# Altium schematic sheet Transmit_Drain.SchDoc
size 558 x 431 mm; SheetNumber: 5; SheetTotal: 9
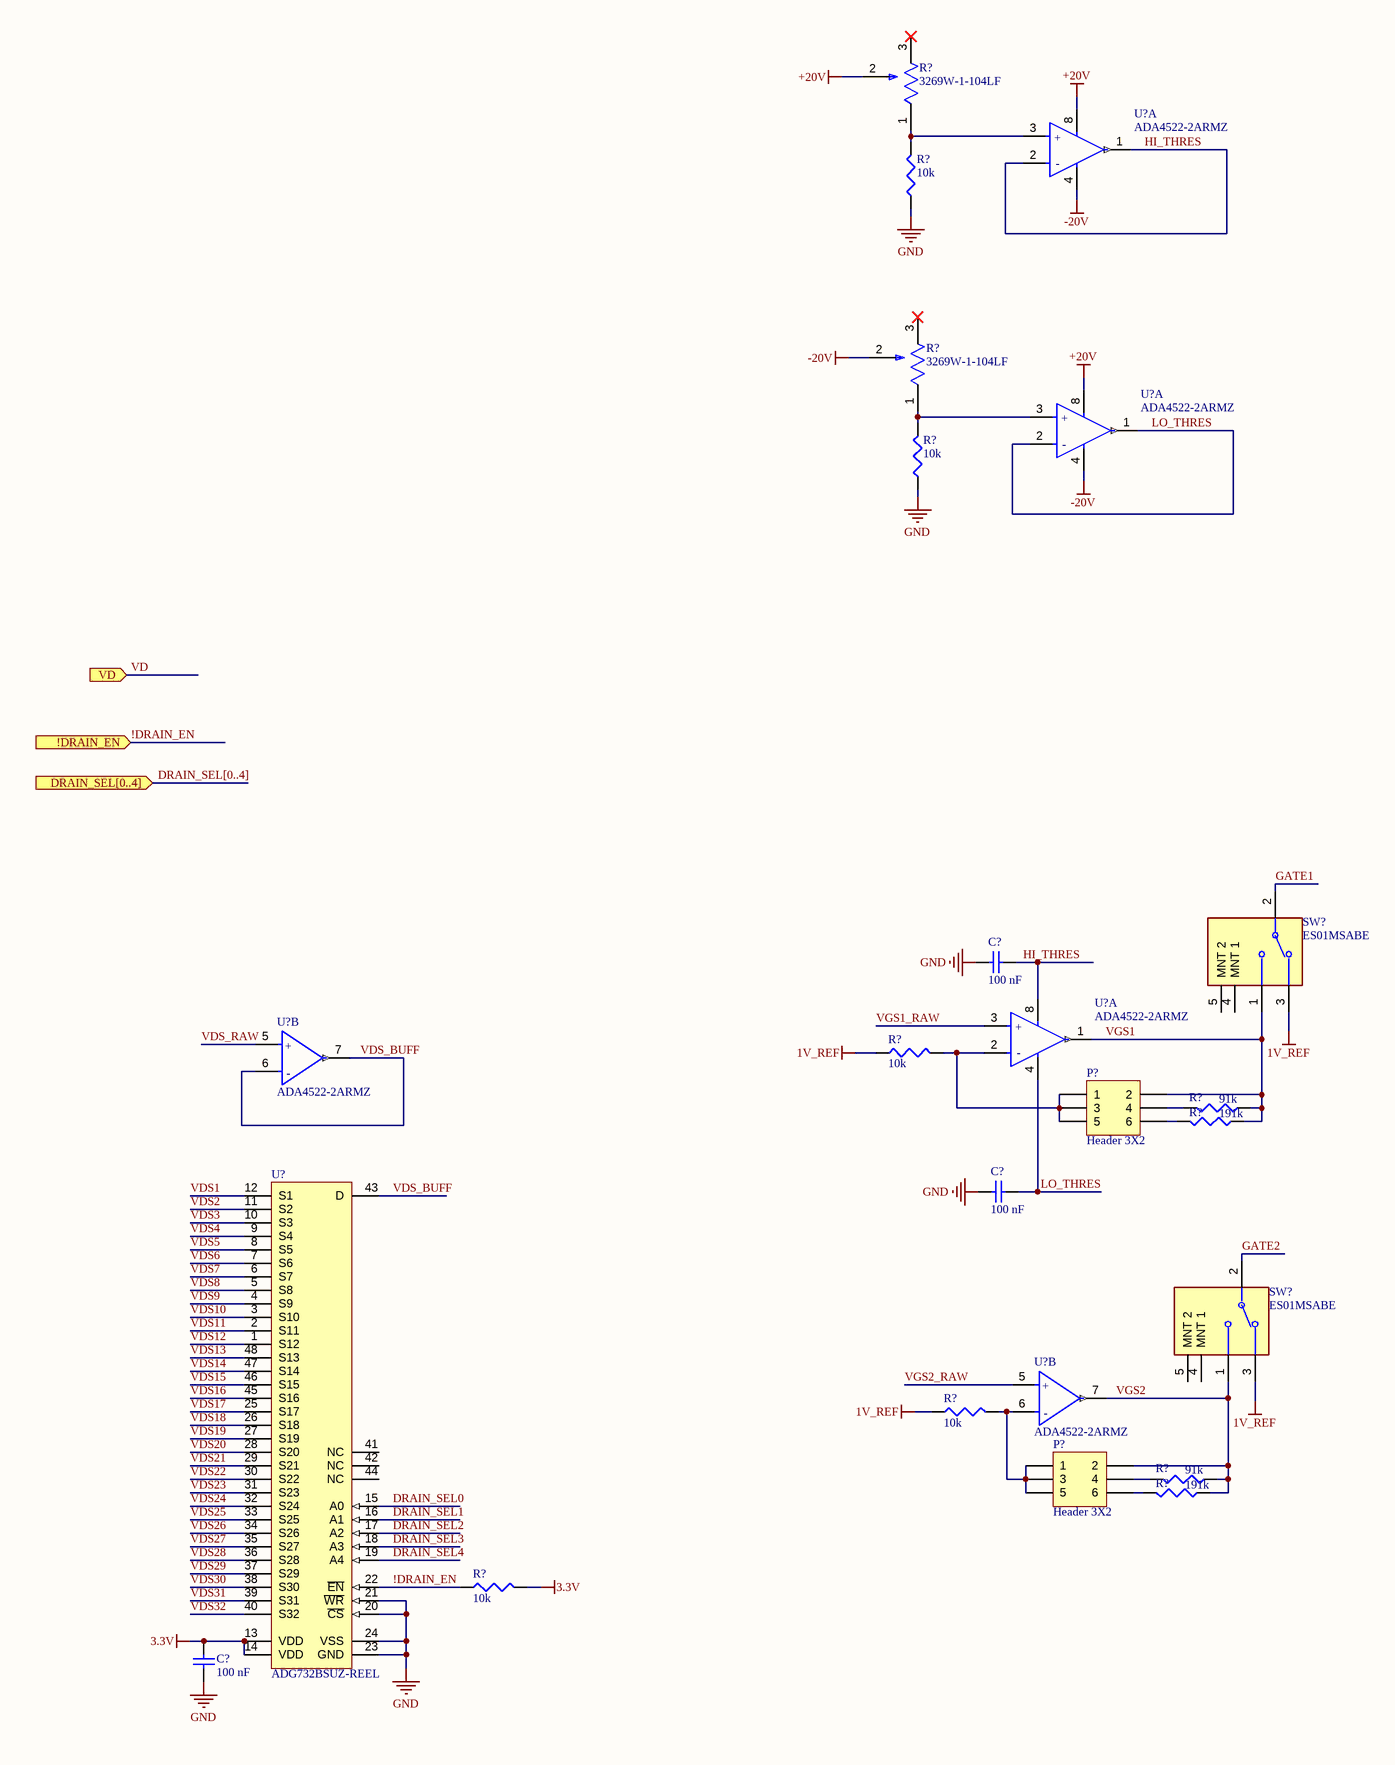
[diagram p0: Transmit_Drain.SchDoc, left]
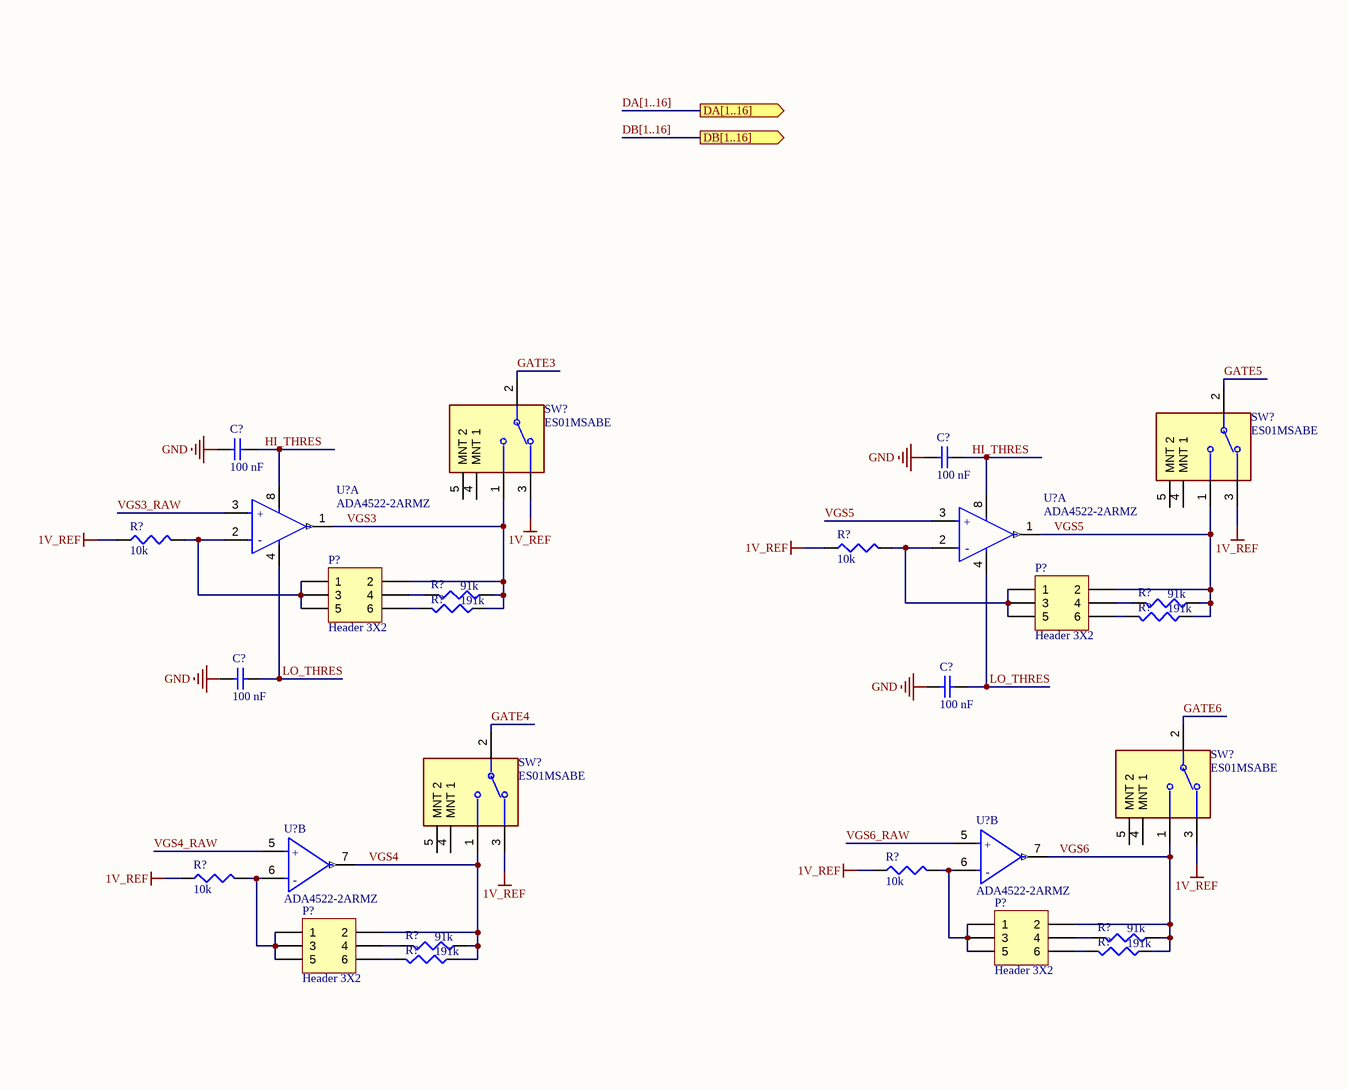
[diagram p1: Transmit_Drain.SchDoc, right]

## Parts
(Parts that share a designator on the sheet are numbered #1, #2 ... from top to bottom, then left to right.)
C?#1  100 nF  [1608[0603]]
C?#2  100 nF  [1608[0603]]
C?#3  100 nF  [1608[0603]]
C?#4  100 nF  [1608[0603]]
C?#5  100 nF  [1608[0603]]
C?#6  100 nF  [1608[0603]]
C?#7  100 nF  [1608[0603]]
P?#1  Header 3X2  [HDR2X3]
P?#2  Header 3X2  [HDR2X3]
P?#3  Header 3X2  [HDR2X3]
P?#4  Header 3X2  [HDR2X3]
P?#5  Header 3X2  [HDR2X3]
P?#6  Header 3X2  [HDR2X3]
R?#1  3269W-1-104LF  [FP-3269W-MFG]
R?#2  10k  [J1-0603]
R?#3  3269W-1-104LF  [FP-3269W-MFG]
R?#4  10k  [J1-0603]
R?#5  10k  [J1-0603]
R?#6  10k  [J1-0603]
R?#7  10k  [J1-0603]
R?#8  91k  [J1-0603]
R?#9  191k  [J1-0603]
R?#10  91k  [J1-0603]
R?#11  191k  [J1-0603]
R?#12  91k  [J1-0603]
R?#13  191k  [J1-0603]
R?#14  10k  [J1-0603]
R?#15  10k  [J1-0603]
R?#16  10k  [J1-0603]
R?#17  91k  [J1-0603]
R?#18  91k  [J1-0603]
R?#19  91k  [J1-0603]
R?#20  191k  [J1-0603]
R?#21  191k  [J1-0603]
R?#22  191k  [J1-0603]
R?#23  10k  [J1-0603]
SW?#1  ES01MSABE  [FP-ES01MSABE-MFG]
SW?#2  ES01MSABE  [FP-ES01MSABE-MFG]
SW?#3  ES01MSABE  [FP-ES01MSABE-MFG]
SW?#4  ES01MSABE  [FP-ES01MSABE-MFG]
SW?#5  ES01MSABE  [FP-ES01MSABE-MFG]
SW?#6  ES01MSABE  [FP-ES01MSABE-MFG]
U?#1  ADA4522-2ARMZ  [FP-RM-8-IPC_C]  (part A of 2)
U?#2  ADA4522-2ARMZ  [FP-RM-8-IPC_C]  (part A of 2)
U?#3  ADA4522-2ARMZ  [FP-RM-8-IPC_C]  (part A of 2)
U?#4  ADA4522-2ARMZ  [FP-RM-8-IPC_C]  (part B of 2)
U?#5  ADA4522-2ARMZ  [FP-RM-8-IPC_C]  (part A of 2)
U?#6  ADA4522-2ARMZ  [FP-RM-8-IPC_C]  (part A of 2)
U?#7  ADG732BSUZ-REEL  [ADI-SU-48_N]
U?#8  ADA4522-2ARMZ  [FP-RM-8-IPC_C]  (part B of 2)
U?#9  ADA4522-2ARMZ  [FP-RM-8-IPC_C]  (part B of 2)
U?#10  ADA4522-2ARMZ  [FP-RM-8-IPC_C]  (part B of 2)

## Ports
!DRAIN_EN (in), DA[1..16] (out), DB[1..16] (out), DRAIN_SEL[0..4] (in), VD (in)

## Nets
1V_REF: R?#5.1 R?#6.1 R?#7.1 R?#14.1 R?#15.1 R?#16.1 SW?#1.3 SW?#2.3 SW?#3.3 SW?#4.3 SW?#5.3 SW?#6.3
3.3V: C?#7.2 R?#23.2 U?#7.13(VDD) U?#7.14(VDD)
+20V: R?#1.2(WIPER) U?#1.8(V+) U?#2.8(V+)
-20V: R?#3.2(WIPER) U?#1.4(V-) U?#2.4(V-)
GND: C?#1.1 C?#2.1 C?#3.1 C?#4.1 C?#5.1 C?#6.1 C?#7.1 R?#2.1 R?#4.1 U?#7.20(~{CS}) U?#7.21(~{WR}) U?#7.23(GND) U?#7.24(VSS)
!DRAIN_EN: R?#23.1 U?#7.22(~{EN}) ; port !DRAIN_EN
DRAIN_SEL0: U?#7.15(A0)
DRAIN_SEL1: U?#7.16(A1)
DRAIN_SEL2: U?#7.17(A2)
DRAIN_SEL3: U?#7.18(A3)
DRAIN_SEL4: U?#7.19(A4)
GATE1: SW?#1.2(COMM)
GATE2: SW?#5.2(COMM)
GATE3: SW?#2.2(COMM)
GATE4: SW?#6.2(COMM)
GATE5: SW?#3.2(COMM)
GATE6: SW?#4.2(COMM)
HI_THRES: C?#1.2 C?#2.2 C?#3.2 U?#1.1(OUT_A) U?#1.2(-IN_A) U?#3.8(V+) U?#5.8(V+) U?#6.8(V+)
LO_THRES: C?#4.2 C?#5.2 C?#6.2 U?#2.1(OUT_A) U?#2.2(-IN_A) U?#3.4(V-) U?#5.4(V-) U?#6.4(V-)
VD: port VD
VDS1: U?#7.12(S1)
VDS2: U?#7.11(S2)
VDS3: U?#7.10(S3)
VDS4: U?#7.9(S4)
VDS5: U?#7.8(S5)
VDS6: U?#7.7(S6)
VDS7: U?#7.6(S7)
VDS8: U?#7.5(S8)
VDS9: U?#7.4(S9)
VDS10: U?#7.3(S10)
VDS11: U?#7.2(S11)
VDS12: U?#7.1(S12)
VDS13: U?#7.48(S13)
VDS14: U?#7.47(S14)
VDS15: U?#7.46(S15)
VDS16: U?#7.45(S16)
VDS17: U?#7.25(S17)
VDS18: U?#7.26(S18)
VDS19: U?#7.27(S19)
VDS20: U?#7.28(S20)
VDS21: U?#7.29(S21)
VDS22: U?#7.30(S22)
VDS23: U?#7.31(S23)
VDS24: U?#7.32(S24)
VDS25: U?#7.33(S25)
VDS26: U?#7.34(S26)
VDS27: U?#7.35(S27)
VDS28: U?#7.36(S28)
VDS29: U?#7.37(S29)
VDS30: U?#7.38(S30)
VDS31: U?#7.39(S31)
VDS32: U?#7.40(S32)
VDS_BUFF: U?#4.6(-IN_B) U?#4.7(OUT_B) U?#7.43(D)
VDS_RAW: U?#4.5(+IN_B)
VGS1: P?#1.2 R?#8.1 R?#9.1 SW?#1.1 U?#3.1(OUT_A)
VGS1_RAW: U?#3.3(+IN_A)
VGS2: P?#6.2 R?#19.1 R?#22.1 SW?#5.1 U?#10.7(OUT_B)
VGS2_RAW: U?#10.5(+IN_B)
VGS3: P?#2.2 R?#10.1 R?#11.1 SW?#2.1 U?#5.1(OUT_A)
VGS3_RAW: U?#5.3(+IN_A)
VGS4: P?#5.2 R?#18.1 R?#21.1 SW?#6.1 U?#9.7(OUT_B)
VGS4_RAW: U?#9.5(+IN_B)
VGS5: P?#3.2 R?#12.1 R?#13.1 SW?#3.1 U?#6.1(OUT_A) U?#6.3(+IN_A)
VGS6: P?#4.2 R?#17.1 R?#20.1 SW?#4.1 U?#8.7(OUT_B)
VGS6_RAW: U?#8.5(+IN_B)
NetP?#1_1: P?#1.1 P?#1.3 P?#1.5 R?#5.2 U?#3.2(-IN_A)
NetP?#1_4: P?#1.4 R?#8.2
NetP?#1_6: P?#1.6 R?#9.2
NetP?#2_1: P?#2.1 P?#2.3 P?#2.5 R?#6.2 U?#5.2(-IN_A)
NetP?#2_4: P?#2.4 R?#10.2
NetP?#2_6: P?#2.6 R?#11.2
NetP?#3_1: P?#3.1 P?#3.3 P?#3.5 R?#7.2 U?#6.2(-IN_A)
NetP?#3_4: P?#3.4 R?#12.2
NetP?#3_6: P?#3.6 R?#13.2
NetP?#4_1: P?#4.1 P?#4.3 P?#4.5 R?#14.2 U?#8.6(-IN_B)
NetP?#4_4: P?#4.4 R?#17.2
NetP?#4_6: P?#4.6 R?#20.2
NetP?#5_1: P?#5.1 P?#5.3 P?#5.5 R?#15.2 U?#9.6(-IN_B)
NetP?#5_4: P?#5.4 R?#18.2
NetP?#5_6: P?#5.6 R?#21.2
NetP?#6_1: P?#6.1 P?#6.3 P?#6.5 R?#16.2 U?#10.6(-IN_B)
NetP?#6_4: P?#6.4 R?#19.2
NetP?#6_6: P?#6.6 R?#22.2
NetR?#1_1: R?#1.1(CCW) R?#2.2 U?#1.3(+IN_A)
NetR?#3_1: R?#3.1(CCW) R?#4.2 U?#2.3(+IN_A)

Not connected (* = marked no-connect by the designer): R?#1 3(CW)*; R?#3 3(CW)*; SW?#1 4(MNT_1) 5(MNT_2); SW?#2 4(MNT_1) 5(MNT_2); SW?#3 4(MNT_1) 5(MNT_2); SW?#4 4(MNT_1) 5(MNT_2); SW?#5 4(MNT_1) 5(MNT_2); SW?#6 4(MNT_1) 5(MNT_2); U?#7 41(NC) 42(NC) 44(NC)

## Buses and harness runs
bus DA[1..16] = port DA[1..16]
bus DB[1..16] = port DB[1..16]
bus DRAIN_SEL[0..4] = port DRAIN_SEL[0..4]

## Notes on the sheet
- DWG. NO.
- REV.
- SHT.
- REVISION
- DESCRIPTION
- DATE
- APPROVED
- THIS DOCUMENT AND THE DATA DISCLOSED HEREIN OR HEREWITH IS THE PROPERTY OF ALTIUM LIMITED AND MAY BE FREELY DISTRIBUTED IN WHOLE. NO RIGHTS ARE RESERVED OR EXPRESS OR IMPLIED WARANTEE GIVEN.
- ENG:
- DSN:
- APPROVALS
- PROJECT
- DOCUMENT REVISION:
- DESIGN ITEM:
- CHK:
- BOM:
- REFERENCE DOCUMENTS
- PROJECT REVISION:
- TITLE
- FAB DWG:
- PCB DWG:
- ASSY DWG:
- SCALE:
- SIZE
- C
- CAGE CODE
- FILE NAME
- DWG NO.
- SHEET
- OF
- REV
- (in symbol CMP-09116-000003-2, part A) +; -
- (in symbol CMP-09116-000003-2, part B) +; -

## Library data of the parts
C?#1-C?#7 = Cap Semi: Published: 8-Jun-2000; LatestRevisionDate: 29-May-2009; LatestRevisionNote: IPC-7351 Footprint Added.; PackageReference: C1206; Publisher: Altium Limited; PackageDescription: Chip Capacitor
P?#1-P?#6 = Header 3X2: Header, 3-Pin, Dual row; LatestRevisionDate: 17-Jul-2002; LatestRevisionNote: Re-released for DXP Platform.; Publisher: Altium Limited
R?#1 R?#3 = CMP-07234-000021-1: TRIMMER 100K OHM 0.25W SMD; Manufacturer: Bourns; Temperature Coefficient: 100ppm/°C; Tolerance: 10%; Resistance: 100kΩ; Description: 100 kOhms 0.25W, 1/4W Gull Wing Surface Mount Trimmer Potentiometer Cermet 12 Turn Top Adjustment; Value: 100kΩ; Composition: Cermet; Height: 8.96mm; ComponentLink2URL: https://www.bourns.com/docs/Product-Datasheets/3269.pdf; Mouser Description: Res Cermet Trimmer 100K Ohm 10% 1/4W 12(Elec)Turn 1.78mm (6.35 X 6.36 X 8.46mm) Gull Wing SMD Tube; ComponentLink2Description: Datasheet; Temperature Range High: +150°C; Temperature: -65°C to +150°C; Series: 3269; Device Class L1: Passive Components; RoHS: TRUE; Octopart: https://octopart.com/3269w-1-104lf-bourns-114162; Temperature Range Low: -65°C; Device Class L2: Resistors; Digikey Description: TRIMMER 100K OHM 0.25W SMD; Manufacturer Part Number: 3269W-1-104LF; Power Rating: 0.25W; Device Class L3: Variable Resistors and Potentiometers; Lead Free: Yes; Package: 3269W; Category: Res; Automotive: No
R?#2 R?#4-R?#23 = Res3: Resistor; Published: 8-Jun-2000; LatestRevisionDate: 29-May-2009; LatestRevisionNote: IPC-7351 Footprint Added.; PackageReference: J1-0603; Publisher: Altium Limited; PackageDescription: Chip Resistor
SW?#1-SW?#6 = CMP-10038-000003-1: SWITCH SLIDE SPDT 0.4VA 20V; Manufacturer: C&K Components; Electromechanical Life: 40000Cycles; Contact Resistance: 50mΩ; Temperature Range High: +85°C; Temperature Range Low: -30°C; Mouser Description: Slide Switches R/A SPDT ON-NONE-ON; Mount: Surface Mount; Lead Free: Yes; Automotive: No; Octopart: https://octopart.com/es01msabe-c%26k+components-2492151; Temperature: -30°C to +85°C; ComponentLink2URL: https://dznh3ojzb2azq.cloudfront.net/products/Slide/ES/documents/datasheet.pdf; Device Class L2: Switches; Throw Configuration: SPDT; Device Class L3: Slide Switches; Voltage Rating Ac: 20V; Category: Switch; Manufacturer Part Number: ES01MSABE; Package: 0; Voltage Rating Dc: 20V; ComponentLink2Description: Datasheet; RoHS: TRUE; Device Class L1: Electromechanical; Digikey Description: SWITCH SLIDE SPDT 0.4VA 20V; Height: 6.65mm
U?#1-U?#6 U?#8-U?#10 = CMP-09116-000003-2: IC OPAMP ZERO-DRIFT 2 CIRC 8MSOP; Max Dual Supply Voltage: 27.5V; Power Supply Rejection Ratio (PSRR): 150dB; Operating Supply Current: 830uA; Max Supply Voltage: 55V; Min Dual Supply Voltage: 2.25V; Input Bias Current: 50pA; Gain Bandwidth Product: 2.7MHz; Voltage Gain: 137dB; Common Mode Rejection Ratio: 140dB; Slew Rate: 1.7V/µs; Input Offset Voltage (Vos): 1.5uV; Output Current per Channel: 32mA; Min Supply Voltage: 4.5V; Packaging: Rail/Tube; Max Operating Temperature: 125°C; Min Operating Temperature: -40°C; Mount: Surface Mount; Number of Pins: 8; Case/Package: MSOP; Lead Free: Contains Lead
U?#7 = CMP-0798-00236-1: 1.8 to 5.5 V / +/-2.5 V, 4 Ohm, 32-Channel Analog Multiplexer, -40 to 85 degC, 48-pin QFP (SU-48), Reel; Manufacturer: Analog Devices; Ron (ohms): 4; Max Analog Signal Range: Vss to Vdd; Bandwidth (Hz): 18M; Supply V Guar Performance: Dual_(+/-2.5V), Single_(+3V), Single_(+5V); t transition (s): 23n; PackageReference: SU-48; ComponentLink3URL: http://www.analog.com/static/imported-files/packages/470644706845302410119987SU48_7x7.pdf; PartNumber: ADG732BSUZ-REEL; ComponentLink1URL: http://www.analog.com/en/index.html; Mounting Technology: Surface Mount; ComponentLink2Description: Datasheet; Packing: Reel; ComponentLink1Description: Manufacturer URL; DatasheetVersion: Rev. 0; ComponentLink2URL: http://www.analog.com/static/imported-files/data_sheets/ADG726_732.pdf; PackageDescription: 48-Pin Thin Plastic Quad Flat Package, Body 7 x 7 mm, Pitch 0.5 mm; Code_JEDEC: MS-026ABC; ComponentLink3Description: Package Specification